# Altium schematic sheet Motor1.SchDoc
size A4
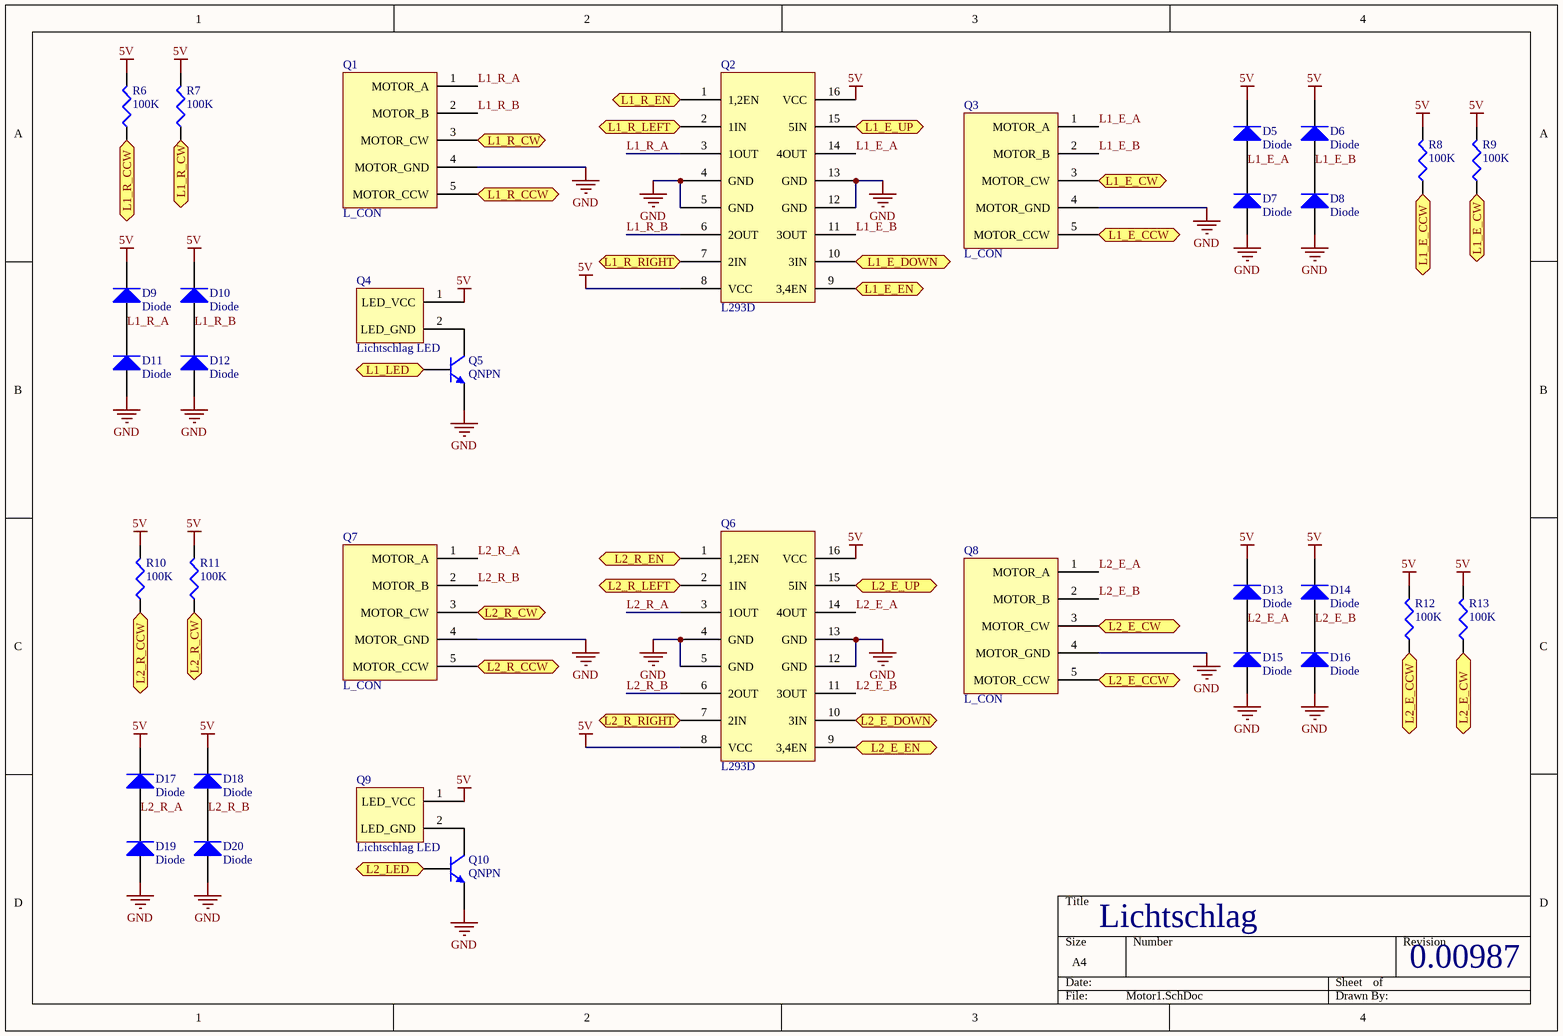
[diagram p0: Motor1.SchDoc]

## Parts
D5  Diode  [3.5X2.8X1.9]
D6  Diode  [3.5X2.8X1.9]
D7  Diode  [3.5X2.8X1.9]
D8  Diode  [3.5X2.8X1.9]
D9  Diode  [3.5X2.8X1.9]
D10  Diode  [3.5X2.8X1.9]
D11  Diode  [3.5X2.8X1.9]
D12  Diode  [3.5X2.8X1.9]
D13  Diode  [3.5X2.8X1.9]
D14  Diode  [3.5X2.8X1.9]
D15  Diode  [3.5X2.8X1.9]
D16  Diode  [3.5X2.8X1.9]
D17  Diode  [3.5X2.8X1.9]
D18  Diode  [3.5X2.8X1.9]
D19  Diode  [3.5X2.8X1.9]
D20  Diode  [3.5X2.8X1.9]
Q1  L_CON  [Lichschlag Connector]
Q2  L293D  [L293D]
Q3  L_CON  [Lichschlag Connector]
Q4  Lichtschlag LED  [Lichtschlag LED]
Q5  QNPN  [SOT-23B_L]
Q6  L293D  [L293D]
Q7  L_CON  [Lichschlag Connector]
Q8  L_CON  [Lichschlag Connector]
Q9  Lichtschlag LED  [Lichtschlag LED]
Q10  QNPN  [SOT-23B_L]
R6  100K  [6-0805_N]
R7  100K  [6-0805_N]
R8  100K  [6-0805_N]
R9  100K  [6-0805_N]
R10  100K  [6-0805_N]
R11  100K  [6-0805_N]
R12  100K  [6-0805_N]
R13  100K  [6-0805_N]

## Ports
L1_E_CCW (out), L1_E_CW (out), L1_E_DOWN (in), L1_E_EN (in), L1_E_UP (in), L1_LED (in), L1_R_CCW (out), L1_R_CW (out), L1_R_EN (in), L1_R_LEFT (in), L1_R_RIGHT (in), L2_E_CCW (out), L2_E_CW (out), L2_E_DOWN (in), L2_E_EN (in), L2_E_UP (in), L2_LED (in), L2_R_CCW (out), L2_R_CW (out), L2_R_EN (in), L2_R_LEFT (in), L2_R_RIGHT (in)

## Nets
5V: D5.2(K) D6.2(K) D9.2(K) D10.2(K) D13.2(K) D14.2(K) D17.2(K) D18.2(K) Q2.8(VCC) Q2.16(VCC) Q4.1(LED_VCC) Q6.8(VCC) Q6.16(VCC) Q9.1(LED_VCC) R6.2 R7.2 R8.2 R9.2 R10.2 R11.2 R12.2 R13.2
GND: D7.1(A) D8.1(A) D11.1(A) D12.1(A) D15.1(A) D16.1(A) D19.1(A) D20.1(A) Q1.4(MOTOR_GND) Q2.4(GND) Q2.5(GND) Q2.12(GND) Q2.13(GND) Q3.4(MOTOR_GND) Q5.3(E) Q6.4(GND) Q6.5(GND) Q6.12(GND) Q6.13(GND) Q7.4(MOTOR_GND) Q8.4(MOTOR_GND) Q10.3(E)
L1_E_A: D5.1(A) D7.2(K) Q2.14(4OUT) Q3.1(MOTOR_A)
L1_E_B: D6.1(A) D8.2(K) Q2.11(3OUT) Q3.2(MOTOR_B)
L1_E_CCW: Q3.5(MOTOR_CCW) R8.1 ; port L1_E_CCW
L1_E_CW: Q3.3(MOTOR_CW) R9.1 ; port L1_E_CW
L1_E_DOWN: Q2.10(3IN) ; port L1_E_DOWN
L1_E_EN: Q2.9(3,4EN) ; port L1_E_EN
L1_E_UP: Q2.15(5IN) ; port L1_E_UP
L1_LED: Q5.2(B) ; port L1_LED
L1_R_A: D9.1(A) D11.2(K) Q1.1(MOTOR_A) Q2.3(1OUT)
L1_R_B: D10.1(A) D12.2(K) Q1.2(MOTOR_B) Q2.6(2OUT)
L1_R_CCW: Q1.5(MOTOR_CCW) R6.1 ; port L1_R_CCW
L1_R_CW: Q1.3(MOTOR_CW) R7.1 ; port L1_R_CW
L1_R_EN: Q2.1(1,2EN) ; port L1_R_EN
L1_R_LEFT: Q2.2(1IN) ; port L1_R_LEFT
L1_R_RIGHT: Q2.7(2IN) ; port L1_R_RIGHT
L2_E_A: D13.1(A) D15.2(K) Q6.14(4OUT) Q8.1(MOTOR_A)
L2_E_B: D14.1(A) D16.2(K) Q6.11(3OUT) Q8.2(MOTOR_B)
L2_E_CCW: Q8.5(MOTOR_CCW) R12.1 ; port L2_E_CCW
L2_E_CW: Q8.3(MOTOR_CW) R13.1 ; port L2_E_CW
L2_E_DOWN: Q6.10(3IN) ; port L2_E_DOWN
L2_E_EN: Q6.9(3,4EN) ; port L2_E_EN
L2_E_UP: Q6.15(5IN) ; port L2_E_UP
L2_LED: Q10.2(B) ; port L2_LED
L2_R_A: D17.1(A) D19.2(K) Q6.3(1OUT) Q7.1(MOTOR_A)
L2_R_B: D18.1(A) D20.2(K) Q6.6(2OUT) Q7.2(MOTOR_B)
L2_R_CCW: Q7.5(MOTOR_CCW) R10.1 ; port L2_R_CCW
L2_R_CW: Q7.3(MOTOR_CW) R11.1 ; port L2_R_CW
L2_R_EN: Q6.1(1,2EN) ; port L2_R_EN
L2_R_LEFT: Q6.2(1IN) ; port L2_R_LEFT
L2_R_RIGHT: Q6.7(2IN) ; port L2_R_RIGHT
NetQ4_2: Q4.2(LED_GND) Q5.1(C)
NetQ9_2: Q9.2(LED_GND) Q10.1(C)

## Notes on the sheet
- Lichtschlag
- 0.00987

## Library data of the parts
D5-D20 = Diode: Default Diode; Published: 8-Jun-2000; LatestRevisionDate: 17-Jul-2002; LatestRevisionNote: Re-released for DXP Platform.; PackageVersion: Sep-1996; PackageReference: SMC; Publisher: Altium Limited; PackageDescription: DO-214-AB/SMC; 2 C-Bend Leads; Body 7.9 x 5.9 mm, inc. leads (LxW); Code_JEDEC: DO-214-AB; Reichelt: https://secure.reichelt.de/1N-UF-AA-Dioden/1N-4148-SMD/3//index.html?ACTION=3&GROUPID=2987&ARTICLE=18403&SEARCH=diode%20SMD&OFFSET=16&WKID=0&
Q1 Q3 Q7 Q8 = Lichtschlag Connector
Q2 Q6 = L293D: H-Bridge
Q4 Q9 = Lichtschlag LED: NPN General Purpose Amplifier
Q5 Q10 = QNPN: NPN Bipolar Transistor; Published: 8-Jun-2000; LatestRevisionDate: 29-May-2009; LatestRevisionNote: IPC-7351 Footprint Added.; PackageVersion: Aug-1999; PackageReference: SOT-23B; Publisher: Altium Limited; PackageDescription: 3-Pin SOT-23 Package 0.95 mm Pitch, 2.4 mm Lead Span; Reichelt: https://secure.reichelt.de/BC-Transistoren/BC-848A-SMD/3//index.html?ACTION=3&GROUPID=2881&ARTICLE=18564&SEARCH=NPN%20SMD&OFFSET=16&WKID=0&
R6-R13 = Res3: Resistor; Published: 8-Jun-2000; LatestRevisionDate: 29-May-2009; LatestRevisionNote: IPC-7351 Footprint Added.; PackageReference: J1-0603; Publisher: Altium Limited; PackageDescription: Chip Resistor; Value: 100K; Reichelt: https://secure.reichelt.de/SMD-0805-100-k-Ohm-820-k-Ohm/SMD-0805-100K/3//index.html?ACTION=3&GROUPID=3099&ARTICLE=32910&SEARCH=100k%20SMD%200805&OFFSET=16&WKID=0&